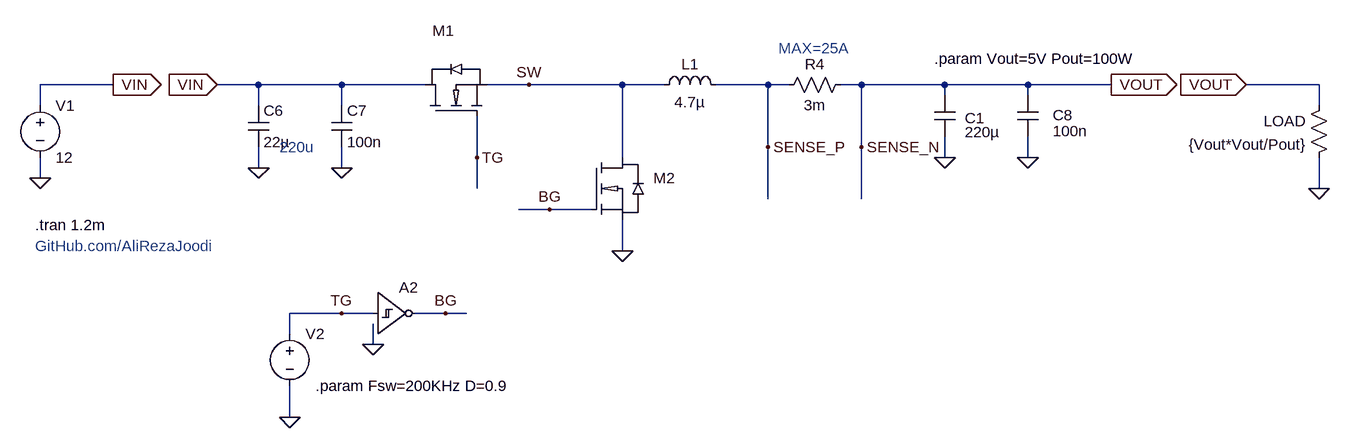
[diagram p0: schematic _PowerStage.asc]
_PowerStage.asc, the LTspice schematic file:
Version 4.1
SHEET 1 2392 964
WIRE -64 -720 -176 -720
WIRE 160 -720 96 -720
WIRE 288 -720 160 -720
WIRE 416 -720 288 -720
WIRE 576 -720 512 -720
WIRE 720 -720 576 -720
WIRE 784 -720 720 -720
WIRE 944 -720 864 -720
WIRE 976 -720 944 -720
WIRE 1088 -720 1056 -720
WIRE 1216 -720 1088 -720
WIRE 1344 -720 1216 -720
WIRE 1472 -720 1344 -720
WIRE 1792 -720 1680 -720
WIRE 1216 -704 1216 -720
WIRE 1344 -704 1344 -720
WIRE -176 -688 -176 -720
WIRE 160 -688 160 -720
WIRE 288 -688 288 -720
WIRE 1792 -688 1792 -720
WIRE 944 -624 944 -720
WIRE 1088 -624 1088 -720
WIRE 496 -608 496 -672
WIRE 720 -608 720 -720
WIRE 1216 -608 1216 -640
WIRE 1344 -608 1344 -640
WIRE 160 -592 160 -624
WIRE 288 -592 288 -624
WIRE -176 -576 -176 -608
WIRE 496 -560 496 -608
WIRE 1792 -560 1792 -608
WIRE 944 -544 944 -624
WIRE 1088 -544 1088 -624
WIRE 608 -528 560 -528
WIRE 672 -528 608 -528
WIRE 720 -464 720 -512
WIRE 288 -368 208 -368
WIRE 336 -368 288 -368
WIRE 448 -368 400 -368
WIRE 480 -368 448 -368
WIRE 208 -336 208 -368
WIRE 336 -320 336 -352
WIRE 208 -208 208 -256
FLAG 720 -464 0
FLAG 1216 -608 0
FLAG 1792 -560 0
FLAG 1472 -720 VOUT
IOPIN 1472 -720 Out
FLAG -176 -576 0
FLAG -64 -720 VIN
IOPIN -64 -720 Out
FLAG 496 -608 TG
FLAG 608 -528 BG
FLAG 576 -720 SW
FLAG 288 -592 0
FLAG 160 -592 0
FLAG 1344 -608 0
FLAG 1680 -720 VOUT
IOPIN 1680 -720 In
FLAG 96 -720 VIN
IOPIN 96 -720 In
FLAG 1088 -624 SENSE_N
FLAG 944 -624 SENSE_P
FLAG 208 -208 0
FLAG 288 -368 TG
FLAG 336 -320 0
FLAG 448 -368 BG
SYMBOL ind 768 -704 R270
WINDOW 0 32 56 VTop 2
WINDOW 3 5 56 VBottom 2
SYMATTR InstName L1
SYMATTR Value 4.7µ
SYMATTR SpiceLine Rser=1.5m
SYMBOL cap 1200 -704 R0
WINDOW 3 47 57 Left 2
WINDOW 0 47 35 Left 2
SYMATTR Value 220µ
SYMATTR InstName C1
SYMATTR SpiceLine Rser=5m
SYMBOL res 1808 -704 M0
SYMATTR InstName LOAD
SYMATTR Value {Vout*Vout/Pout}
SYMBOL res 960 -704 R270
WINDOW 0 32 56 VTop 2
WINDOW 3 0 56 VBottom 2
SYMATTR InstName R4
SYMATTR Value 3m
SYMBOL cap 144 -688 R0
SYMATTR InstName C6
SYMATTR Value 22µ
SYMBOL cap 272 -688 R0
SYMATTR InstName C7
SYMATTR Value 100n
SYMBOL cap 1328 -704 R0
WINDOW 0 54 31 Left 2
WINDOW 3 54 55 Left 2
SYMATTR InstName C8
SYMATTR Value 100n
SYMBOL voltage -176 -704 R0
WINDOW 123 0 0 Left 0
WINDOW 39 0 0 Left 0
SYMATTR InstName V1
SYMATTR Value 12
SYMBOL voltage 208 -352 R0
WINDOW 3 41 64 Invisible 2
WINDOW 123 0 0 Left 0
SYMATTR Value PULSE(0 18 0 {0.01/Fsw} {0.01/Fsw} {D/Fsw} {1/Fsw})
SYMATTR InstName V2
SYMATTR SpiceLine Rser=10
SYMBOL MyLib\\Transistor_MOSFET_N\\MOSFET_N 416 -672 R270
WINDOW 3 96 56 Invisible 2
WINDOW 0 131 12 VRight 2
SYMATTR Value RJK0305DPB
SYMATTR InstName M1
SYMBOL MyLib\\Transistor_MOSFET_N\\MOSFET_N 672 -608 R0
WINDOW 3 96 56 Invisible 2
SYMATTR Value RJK0305DPB
SYMATTR InstName M2
SYMBOL Digital\\schmtinv 336 -432 R0
WINDOW 3 8 60 Invisible 2
SYMATTR Value Vhigh=15
SYMATTR InstName A2
TEXT -184 -504 Left 2 !.tran 1.2m
TEXT -184 -472 Left 2 ;GitHub.com/AliRezaJoodi
TEXT 960 -776 Left 2 ;MAX=25A
TEXT 192 -624 Left 2 ;220u
TEXT 1200 -760 Left 2 !.param Vout=5V Pout=100W
TEXT 248 -256 Left 2 !.param Fsw=200KHz D=0.9

The netlist it stands for:
* _PowerStage.asc
L1 SW SENSE_P 4.7µ Rser=1.5m
C1 SENSE_N 0 220µ Rser=5m
R§LOAD SENSE_N 0 {Vout*Vout/Pout}
R4 SENSE_P SENSE_N 3m
C6 VIN 0 22µ
C7 VIN 0 100n
C8 SENSE_N 0 100n
V1 VIN 0 12
V2 TG 0 PULSE(0 18 0 {0.01/Fsw} {0.01/Fsw} {D/Fsw} {1/Fsw}) Rser=10
M1 VIN TG SW SW RJK0305DPB
M2 SW BG 0 0 RJK0305DPB
A2 TG 0 0 0 0 BG 0 0 SCHMITT Vhigh=15
.model NMOS NMOS
.model PMOS PMOS
.lib standard.mos
.tran 1.2m
* GitHub.com/AliRezaJoodi
* MAX=25A
* 220u
.param Vout=5V Pout=100W
.param Fsw=200KHz D=0.9
.backanno
.end